# EAGLE design LCD (EAGLE 4.11)
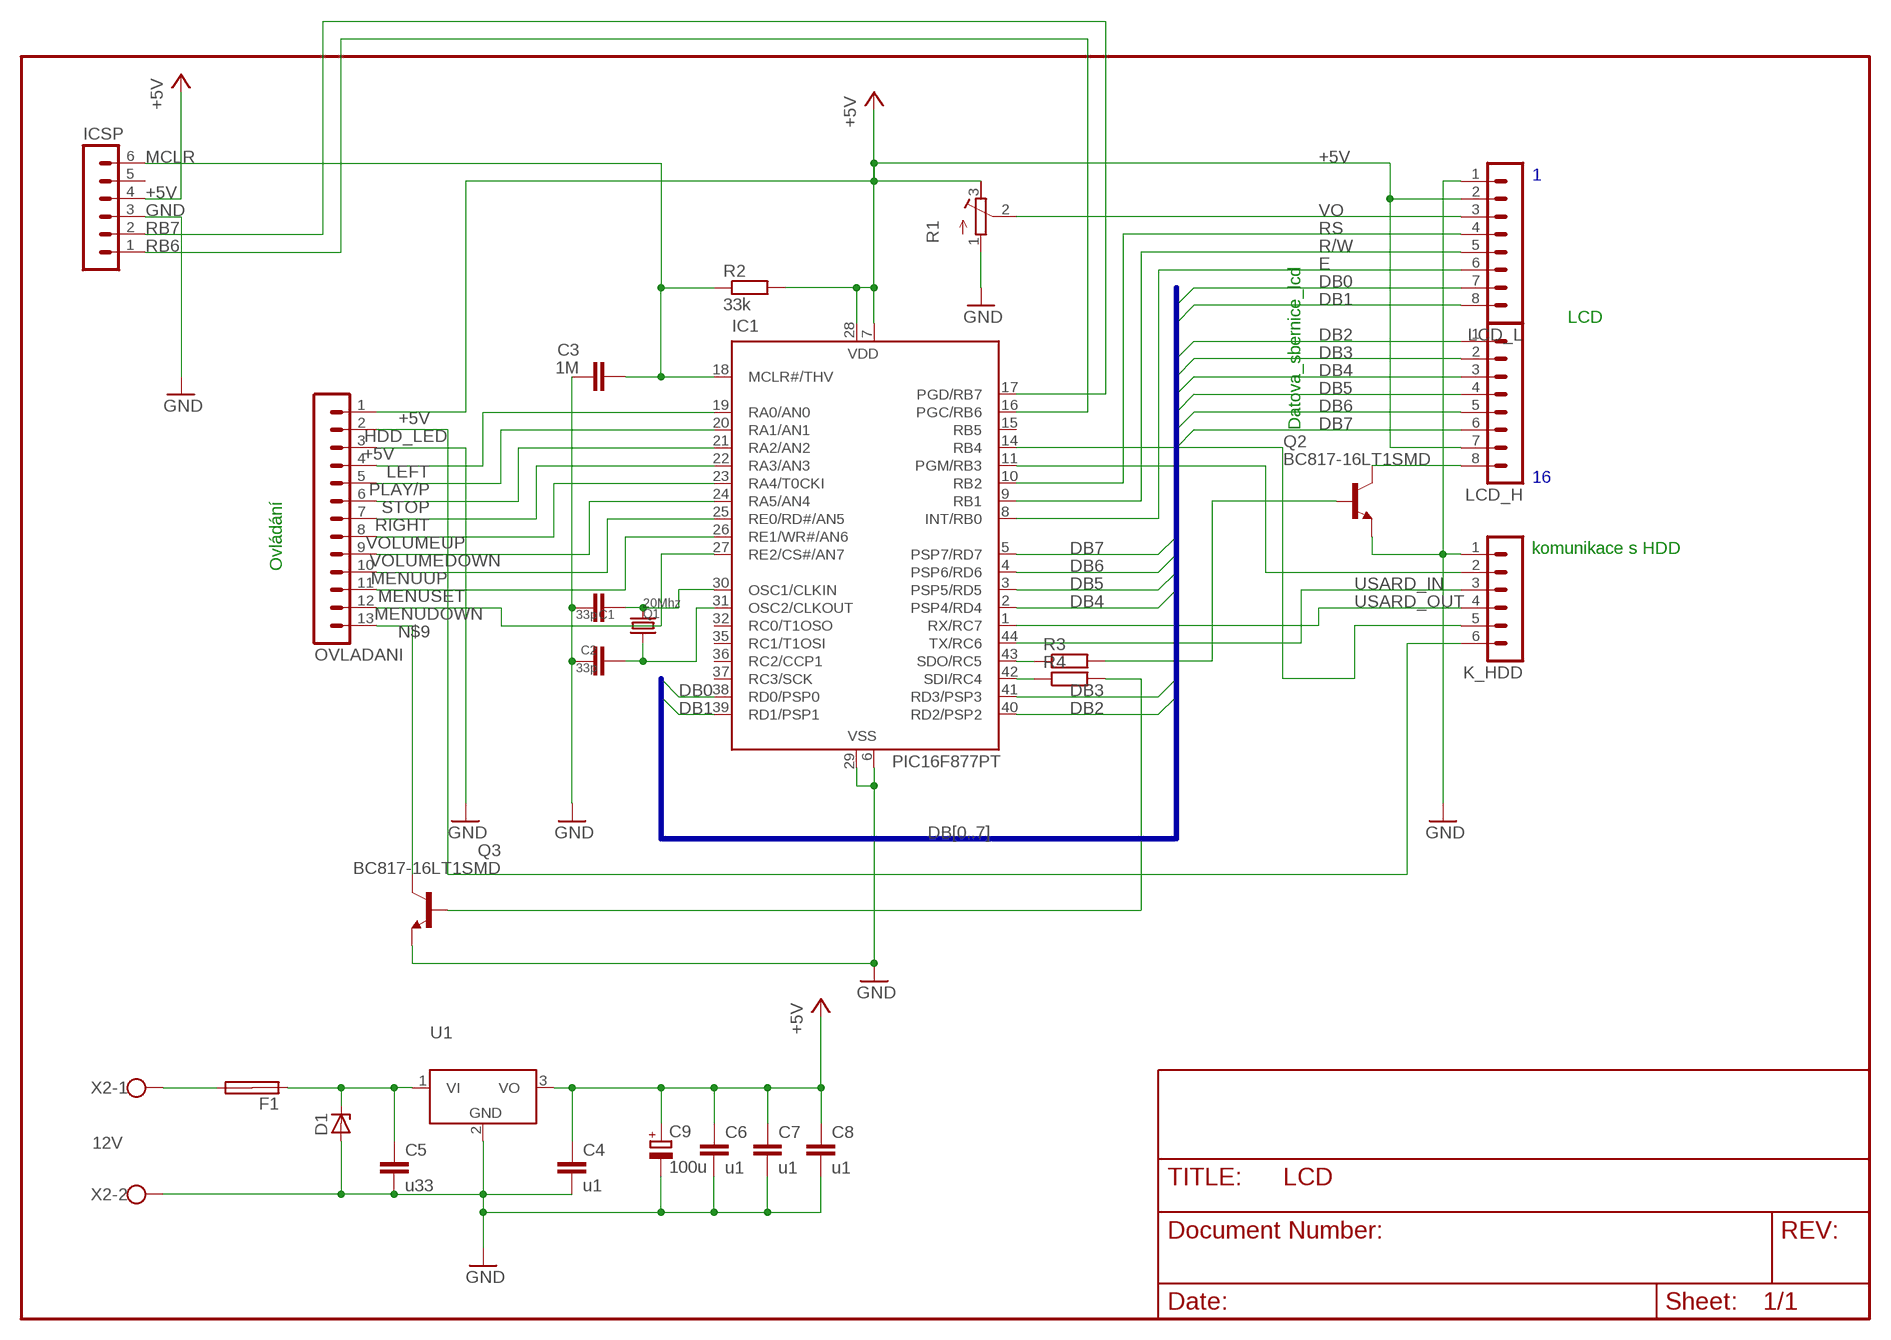
[diagram p0: schematic, sheet 1]

## Parts
C1  33p  C-EUC0805  [C0805]
C2  33p  C-EUC0805  [C0805]
C3  1M  C-EUC0805  [C0805]
C4  u1  C-EUC0603K  [C0603K]
C5  u33  C-EUC0603K  [C0603K]
C6  u1  C-EUC0603K  [C0603K]
C7  u1  C-EUC0603K  [C0603K]
C8  u1  C-EUC0603K  [C0603K]
C9  100u  CPOL-EUE3.5-8  [E3,5-8]
D1  ZENER-DIODEF126-10  [F126Z10]
F1  SHK20L  [SHK20L]
IC1  PIC16F877PT  [TQFP44]
ICSP  MA06-1  [MA06-1]
K_HDD  MA06-1  [MA06-1]
LCD_H  MA08-1  [MA08-1]
LCD_L  MA08-1  [MA08-1]
OVLADANI  MA13-1  [MA13-1]
Q1  20Mhz  CRYTALHC18U-V  [HC18U-V]
Q2  BC817-16LT1SMD  [SOT23-BEC]
Q3  BC817-16LT1SMD  [SOT23-BEC]
R1  R-TRIMM74X  [RTRIM74X]
R2  33k  R-EU_R0805  [R0805]
R3  R-EU_M0805  [M0805]
R4  R-EU_M0805  [M0805]
U1  7806  [TO-220S]
X2  12V  W237-102  [W237-102]

## Nets
+5V: C4.1 C6.1 C7.1 C8.1 C9.+ IC1.7(VDD) IC1.28(VDD) ICSP.4 LCD_H.7 LCD_L.2 OVLADANI.1 R1.3(A) R2.2 U1.3(VO)
DB0: IC1.38(RD0/PSP0) LCD_L.7
DB1: IC1.39(RD1/PSP1) LCD_L.8
DB2: IC1.40(RD2/PSP2) LCD_H.1
DB3: IC1.41(RD3/PSP3) LCD_H.2
DB4: IC1.2(PSP4/RD4) LCD_H.3
DB5: IC1.3(PSP5/RD5) LCD_H.4
DB6: IC1.4(PSP6/RD6) LCD_H.5
DB7: IC1.5(PSP7/RD7) LCD_H.6
E: IC1.8(INT/RB0) LCD_L.6
GND: C1.1 C2.1 C3.1 C4.2 C5.2 C6.2 C7.2 C8.2 C9.- D1.A IC1.6(VSS) IC1.29(VSS) ICSP.3 K_HDD.1 LCD_L.1 OVLADANI.3 Q2.E Q3.E R1.1(E) U1.2(GND) X2.2
HDD_LED: K_HDD.6 OVLADANI.2
LEFT: IC1.19(RA0/AN0) OVLADANI.4
MCLR: C3.2 IC1.18(MCLR#/THV) ICSP.6 R2.1
MENUDOWN: IC1.27(RE2/CS#/AN7) OVLADANI.12
MENUSET: IC1.26(RE1/WR#/AN6) OVLADANI.11
MENUUP: IC1.25(RE0/RD#/AN5) OVLADANI.10
N$1: C1.2 IC1.30(OSC1/CLKIN) Q1.2
N$2: C2.2 IC1.31(OSC2/CLKOUT) Q1.1
N$4: F1.2A X2.1
N$5: C5.1 D1.C F1.1A U1.1(VI)
N$6: LCD_H.8 Q2.C
N$7: IC1.11(PGM/RB3) K_HDD.2
N$8: IC1.43(SDO/RC5) R3.1
N$9: OVLADANI.13 Q3.C
N$10: Q2.B R3.2
N$11: IC1.14(RB4) K_HDD.5
N$12: IC1.42(SDI/RC4) R4.1
N$13: Q3.B R4.2
PLAY/P: IC1.20(RA1/AN1) OVLADANI.5
R/W: IC1.9(RB1) LCD_L.5
RB6: IC1.16(PGC/RB6) ICSP.1
RB7: IC1.17(PGD/RB7) ICSP.2
RIGHT: IC1.22(RA3/AN3) OVLADANI.7
RS: IC1.10(RB2) LCD_L.4
STOP: IC1.21(RA2/AN2) OVLADANI.6
USARD_IN: IC1.44(TX/RC6) K_HDD.3
USARD_OUT: IC1.1(RX/RC7) K_HDD.4
VO: LCD_L.3 R1.2(S)
VOLUMEDOWN: IC1.24(RA5/AN4) OVLADANI.9
VOLUMEUP: IC1.23(RA4/T0CKI) OVLADANI.8
Unconnected: F1.1B F1.2B IC1.15(RB5) IC1.32(RC0/T1OSO) IC1.35(RC1/T1OSI) IC1.36(RC2/CCP1) IC1.37(RC3/SCK) ICSP.5

## Buses
DB[0..7]

## Notes on the sheet
- 1
- LCD
- Datova_sbernice_lcd
- 16
- Ovládání
- komunikace s HDD

## Library data of the parts
C1-C8 = rcl:C-EU: CAPACITOR, European symbol
C9 = rcl:CPOL-EU: POLARIZED CAPACITOR, European symbol
D1 = diode:ZENER-DIODE: Z-Diode
F1 = fuse:SHK20L: FUSE HOLDER 5 x 20 mm, SH contact, SHH1 Schukat, E1073 Buerklin
IC1 = microchip:PIC16F87*: MICROCONTROLLER
ICSP K_HDD = con-lstb:MA06-1: PIN HEADER
LCD_H LCD_L = con-lstb:MA08-1: PIN HEADER
OVLADANI = con-lstb:MA13-1: PIN HEADER
Q1 = crystal:CRYTAL: CRYSTAL
Q2 Q3 = transistor-npn:BC817*: NPN Transistor
R1 = rcl:R-TRIMM: Trimm resistor
R2-R4 = rcl:R-EU_: RESISTOR, European symbol
U1 = GM99:7806
X2 = con-wago-500:W237-102: WAGO SCREW CLAMP

## Board
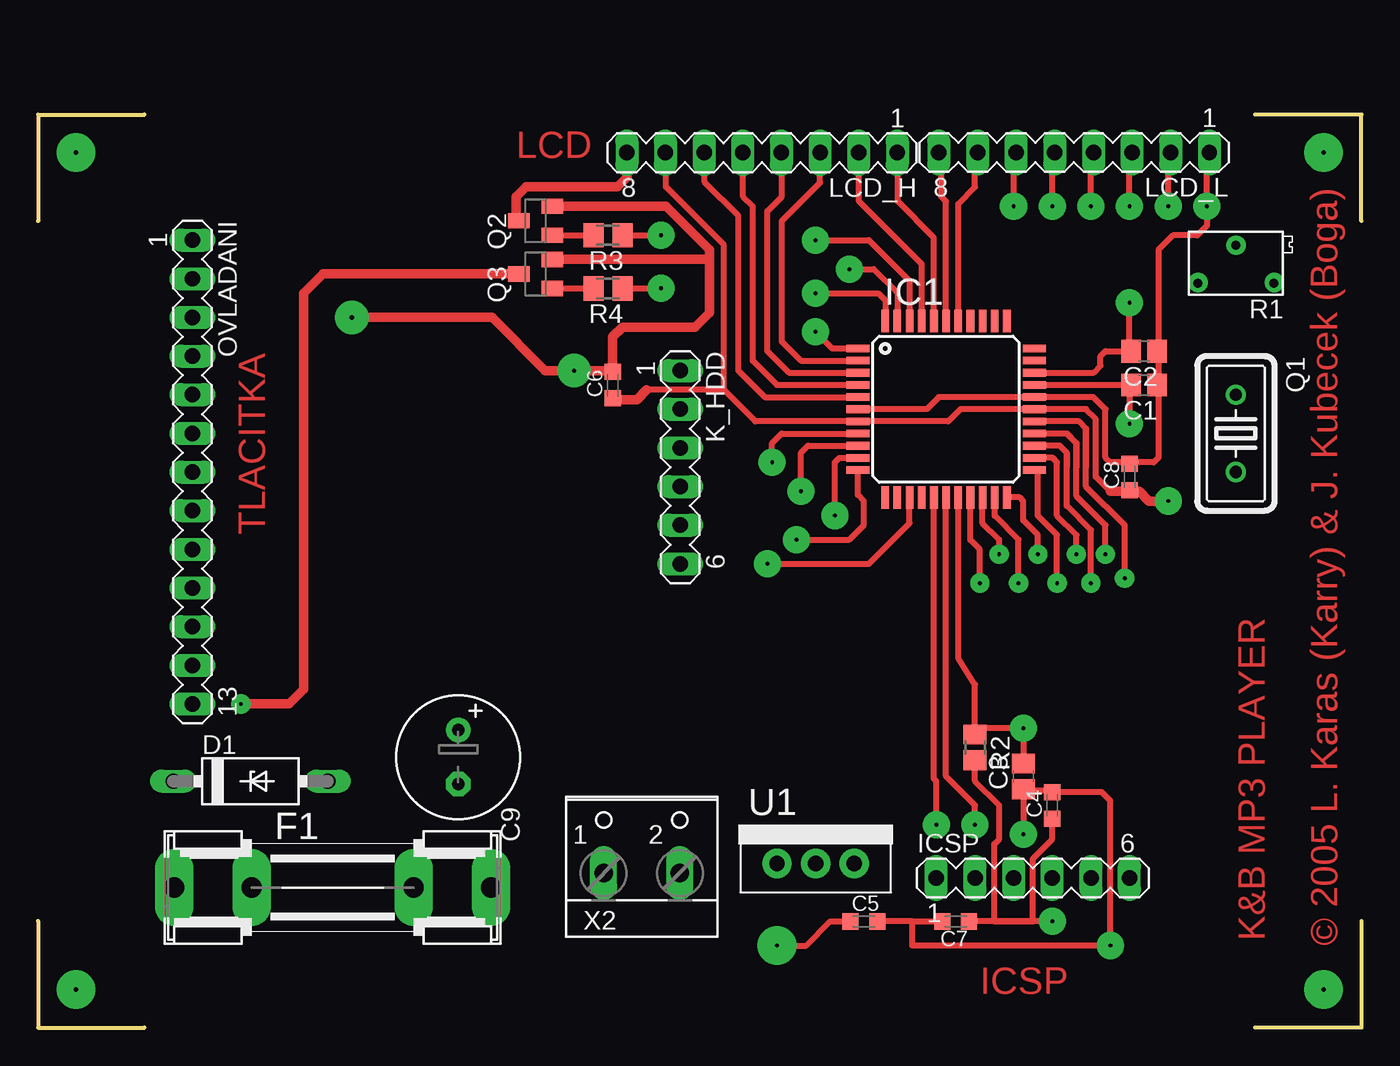
[diagram p1: board, top side]
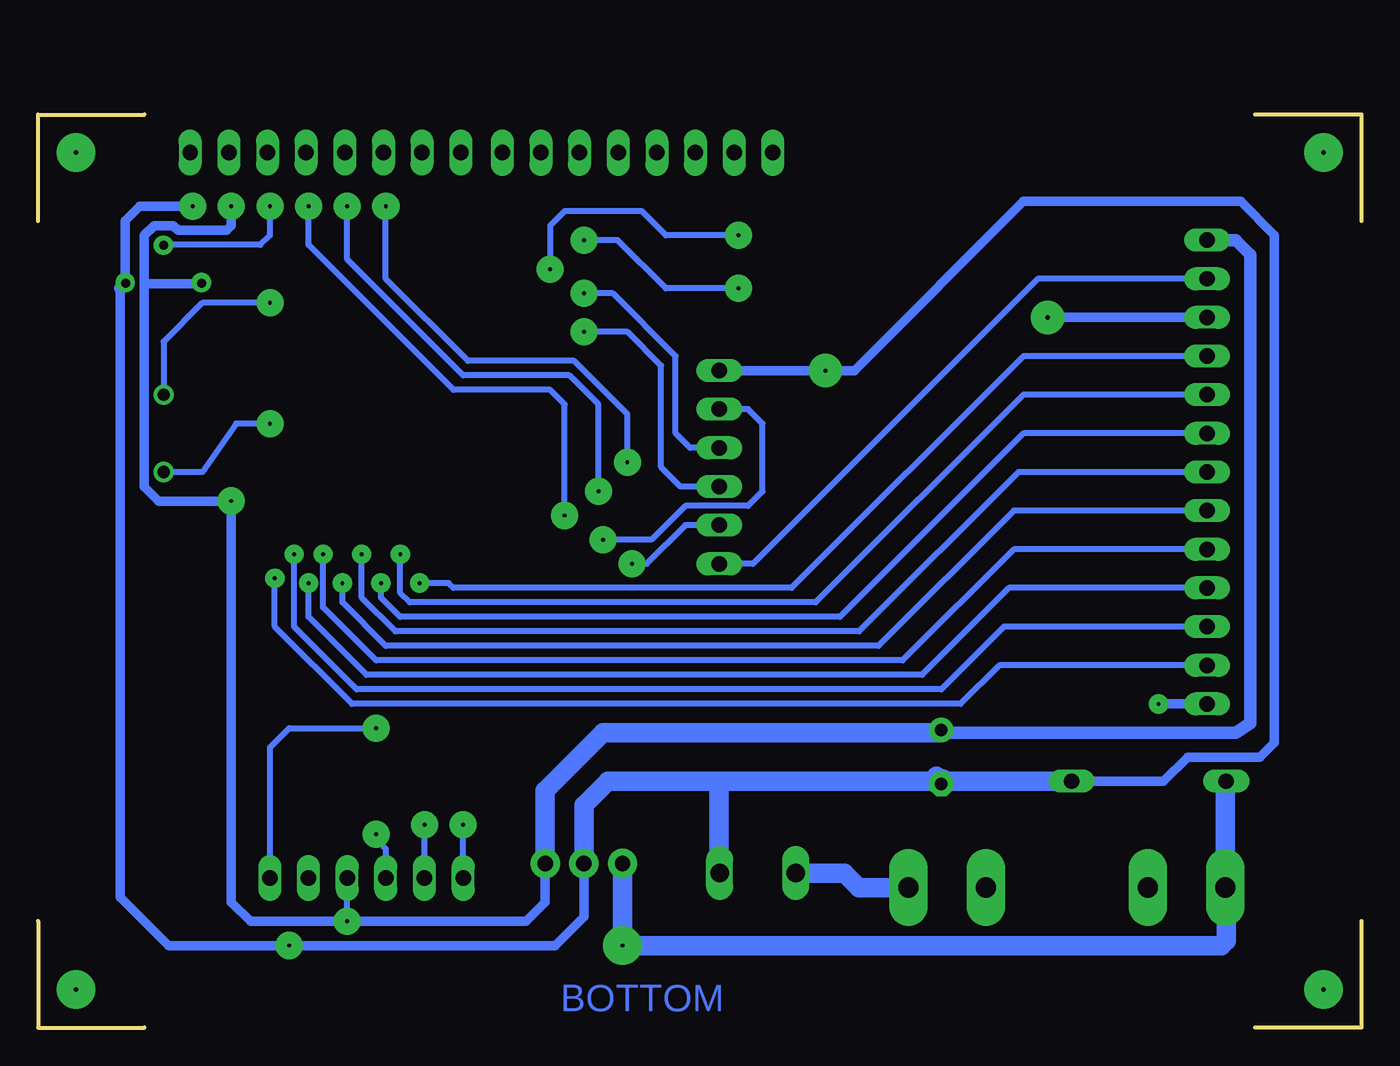
[diagram p2: board, bottom side, seen from below]

Size 87 x 60 mm. Coordinates in mm from the lower left corner, seen from the top.
Outline: 7,60 0,60 0,53
Outline: 0,7 0,0 7,0
Outline: 87,7 87,0 80,0
Outline: 87,53 87,60 80,60
Copper layers (1*16): Top 0.035mm / dielectric 1.5mm / Bottom 0.035mm
Design rules "default": minimum track width 10mil, minimum drill 24mil, track to track 8mil, track to pad 8mil, pad to pad 8mil, via to via 8mil, smd to smd 8mil, copper to edge 40mil, drill to drill 8mil, minimum pad ring 10mil, minimum via ring 8mil, stop-mask expansion 4mil, vias tented up to drill 0mil, thermal gap 10mil

### Footprints (pad centres in the part's own frame; a part is rotated, then mirrored left to right if it is on the bottom)
C0805 = smd 1.3 x 1.5: 1 -0.85,0; 2 0.85,0
C0603K = smd 1.05 x 1.08: 1 -0.875,0; 2 0.875,0
E3,5-8 = drill 0.813 pad 1.6 round: + -1.778,0 | drill 0.813 pad 1.6 octagon: - 1.778,0
F126Z10 = drill 1.016 long: A 5.08,0; C -5.08,0
SHK20L = drill 1.321 pad 2.54 long: 1A -10.414,0; 1B -5.334,0; 2A 10.414,0; 2B 5.334,0
TQFP44 = smd 1.5 x 0.5: 1 -5.8,4; 2 -5.8,3.2; 3 -5.8,2.4; 4 -5.8,1.6; 5 -5.8,0.8; 6 -5.8,0; 7 -5.8,-0.8; 8 -5.8,-1.6; 9 -5.8,-2.4; 10 -5.8,-3.2; 11 -5.8,-4; 23 5.8,-4; 24 5.8,-3.2; 25 5.8,-2.4; 26 5.8,-1.6; 27 5.8,-0.8; 28 5.8,0; 29 5.8,0.8; 30 5.8,1.6; 31 5.8,2.4; 32 5.8,3.2; 33 5.8,4 | smd 0.5 x 1.5: 12 -4,-5.8; 13 -3.2,-5.8; 14 -2.4,-5.8; 15 -1.6,-5.8; 16 -0.8,-5.8; 17 0,-5.8; 18 0.8,-5.8; 19 1.6,-5.8; 20 2.4,-5.8; 21 3.2,-5.8; 22 4,-5.8; 34 4,5.8; 35 3.2,5.8; 36 2.4,5.8; 37 1.6,5.8; 38 0.8,5.8; 39 0,5.8; 40 -0.8,5.8; 41 -1.6,5.8; 42 -2.4,5.8; 43 -3.2,5.8; 44 -4,5.8
MA06-1 = drill 1.016 long: 1 -6.35,0; 2 -3.81,0; 3 -1.27,0; 4 1.27,0; 5 3.81,0; 6 6.35,0
MA08-1 = drill 1.016 long: 1 -8.89,0; 2 -6.35,0; 3 -3.81,0; 4 -1.27,0; 5 1.27,0; 6 3.81,0; 7 6.35,0; 8 8.89,0
MA13-1 = drill 1.016 long: 1 -15.24,0; 2 -12.7,0; 3 -10.16,0; 4 -7.62,0; 5 -5.08,0; 6 -2.54,0; 7 0,0; 8 2.54,0; 9 5.08,0; 10 7.62,0; 11 10.16,0; 12 12.7,0; 13 15.24,0
HC18U-V = drill 0.813 round: 1 -2.54,0; 2 2.54,0
SOT23-BEC = smd 1 x 1.4: B -0.95,-1.1; C 0,1.1; E 0.95,-1.1
RTRIM74X = drill 0.61 round: 1 -1.25,-2.5; 2 1.25,0; 3 -1.25,2.5
R0805 = smd 1.3 x 1.5: 1 -0.85,0; 2 0.85,0
M0805 = smd 1.3 x 1.6: 1 -0.95,0; 2 0.95,0
TO-220S = drill 1.016 pad 1.93 round: 1 0,0; 2 2.54,0; 3 5.08,0
W237-102 = drill 1.194 long: 1 -2.5,-1.27; 2 2.5,-1.27

### Placement (x,y rotation side)
C1  72.71,42.23 180 top
C2  72.71,44.45 180 top
C3  64.77,16.51 90 top
C4  66.67,14.61 90 top
C5  54.29,6.99 0 top
C6  37.78,42.23 90 top
C7  60.33,6.99 180 top
C8  71.75,36.2 90 top
C9  27.62,17.78 270 top
D1  13.97,16.19 0 top
F1  19.37,9.21 0 top
IC1  59.69,40.64 0 top
ICSP  65.41,9.84 0 top
K_HDD  42.23,36.83 270 top
LCD_H  47.6,57.5 180 top
LCD_L  68.11,57.52 180 top
OVLADANI  10.16,36.51 270 top
Q1  78.74,39.05 270 top
Q2  32.7,53.02 90 top
Q3  32.7,49.53 90 top
R1  78.74,50.16 90 top
R2  61.59,18.41 270 top
R3  37.47,52.07 180 top
R4  37.47,48.58 180 top
U1  48.58,10.79 0 top
X2  39.69,11.43 0 top

### Tracks (layer width: path | path; a pad name or v marks a point on that pad's centre or on a via)
+5V  (via drill 0.25 pad 1.78)
  Top 0.406: 45.09,41.91 47.16,39.84 IC1.7 59.84,39.84 60.64,40.64 IC1.28 68.9,40.64 69.53,40.01 69.53,36.2 70.48,35.24 71.75,35.24 | 45.09,41.91 45.09,51.44 41.27,55.24 41.27,57.47 LCD_H.7 | LCD_L.2 74.46,57.31 74.3,57.15 v74.3,53.98 | R2.2 61.59,16.19 63.18,14.61 63.18,12.38 62.87,12.06 62.87,6.99 | 72.39,35.24 71.75,35.24 | 71.75,35.24 C8.1 | C4.1 66.67,12.38 65.41,11.11 65.41,6.99 62.87,6.99 | v66.67,6.99 62.87,6.99 | 62.87,6.99 C7.1 | 37.78,41.27 C6.1 | 45.09,41.91 40.01,41.91
  Top 0.61: 40.01,41.91 39.37,41.27 37.78,41.27 | 70.48,35.24 72.39,35.24 73.03,34.61 v74.3,34.61
  Bottom 0.406: 76.2,48.9 76.22,48.91 R1.3 | v66.67,6.99 ICSP.4
  Bottom 0.61: v74.3,53.98 74.3,52.7 74.61,52.39 77.79,52.39 78.11,52.7 79.38,52.7 80.01,52.07 80.01,48.9 | 80.01,48.9 76.2,48.9 | 80.01,48.9 80.01,35.56 79.06,34.61 v74.3,34.61 74.3,8.26 73.03,6.99 v66.67,6.99 54.93,6.99 53.66,8.26 U1.3
  Bottom 0.813: 27.62,19.37 8.26,19.37 7.3,20 7.3,46.67 7.3,50.8 8.26,51.75 OVLADANI.1
  Bottom 1.27: U1.3 53.66,15.56 49.85,19.37 27.62,19.37 C9.+
DB0
  Top 0.406: IC1.38 60.49,54.14 61.59,55.24 61.59,57.15 61.91,57.47 61.86,57.52 LCD_L.7
DB1
  Top 0.406: IC1.39 59.69,54.29 59.37,54.61 59.37,57.47 59.32,57.52 LCD_L.8
DB2
  Top 0.406: IC1.40 58.89,51.92 56.52,54.29 56.52,57.47 LCD_H.1
DB3
  Top 0.406: IC1.41 58.09,50.18 53.98,54.29 53.98,57.47 LCD_H.2
DB4
  Top 0.406: 51.44,57.47 51.44,57.5 LCD_H.3 51.41,55.53 48.9,53.02 48.9,45.09 50.14,43.84 IC1.2
DB5
  Top 0.406: IC1.3 49.35,43.04 47.94,44.45 47.94,53.66 48.9,54.61 48.9,57.47 LCD_H.4
DB6
  Top 0.406: IC1.4 48.56,42.24 46.99,43.81 46.99,53.98 46.35,54.61 46.35,57.47 LCD_H.5
DB7
  Top 0.406: IC1.5 47.78,41.44 46.04,43.18 46.04,53.34 43.81,55.56 43.81,57.47 LCD_H.6
E  (via drill 0.25 pad 1.78)
  Top 0.406: LCD_L.6 64.3,56.99 64.14,56.83 v64.14,53.98 | IC1.8 48.88,39.04 48.26,38.42 v48.26,37.15
  Bottom 0.406: v48.26,37.15 48.26,40.32 51.75,43.81 58.74,43.81 64.14,49.21 v64.14,53.98
GND  (via drill 0.25 pad 1.78, 0.25 pad 2.18, 0.3 pad 2.18)
  Top 0.406: IC1.6 58.42,40.64 59.22,41.44 IC1.29 69.37,41.44 70.17,40.64 70.17,37.47 70.48,37.15 71.75,37.15 | LCD_L.1 77,56.99 76.83,56.83 v76.83,53.98 76.83,52.7 76.2,52.07 74.61,52.07 73.66,51.12 73.66,44.45 | 73.66,44.45 C2.1 | 73.66,44.45 73.66,42.23 | 73.66,42.23 C1.1 | 71.75,37.15 73.34,37.15 73.66,37.47 73.66,42.23 | 71.75,37.15 C8.2 | 64.77,15.56 C3.1 | 64.77,15.56 66.67,15.56 C4.2 69.93,15.48 70.48,14.92 v70.48,5.4 57.47,5.4 57.47,6.99 | 64.77,15.56 v64.77,12.7 | 57.47,6.99 C7.2 | 57.47,6.99 C5.2 | 37.78,43.18 C6.2 | 44.13,50.48
  Top 0.61: Q2.E 41.28,53.97 44.13,51.12 44.13,50.48 44.13,46.99 43.18,46.04 38.42,46.04 37.78,45.4 37.78,43.18 v35.24,43.18 33.34,43.18 29.84,46.67 v20.64,46.67 | 44.13,50.48 Q3.E
  Bottom 0.406: v64.77,12.7 64.77,12.38 64.14,11.75 ICSP.3 | 18.1,16.19 18.41,15.88 18.73,15.88 D1.A
  Bottom 0.61: v76.83,53.98 80.33,53.98 81.28,53.02 81.28,48.9 | U1.2 51.12,7.3 53.02,5.4 v70.48,5.4 78.42,5.4 81.6,8.57 81.6,48.58 | 18.1,16.19 13.02,16.19 11.43,17.78 6.67,17.78 5.71,18.73 5.71,52.07 7.94,54.29 22.23,54.29 33.34,43.18 v35.24,43.18 K_HDD.1 | v20.64,46.67 OVLADANI.3
  Bottom 0.813: R1.1 81.26,48.91 81.28,48.9 81.6,48.58
  Bottom 1.27: D1.A 27.62,16.19 | 27.62,16.19 42.23,16.19 | X2.2 42.19,9.88 42.23,9.84 42.23,16.19 | 27.62,16.19 27.94,16.51 27.5,16.32 C9.- | U1.2 51.12,14.61 49.53,16.19 42.23,16.19
HDD_LED
  Bottom 0.406: OVLADANI.2 21.27,49.21 40.01,30.48 K_HDD.6
LEFT  (via drill 0.25 pad 1.27)
  Top 0.406: IC1.19 61.29,32.05 61.91,31.43 v61.91,29.21
  Bottom 0.406: v61.91,29.21 60.01,29.21 59.69,28.89 37.47,28.89 22.23,44.13 OVLADANI.4
MCLR  (via drill 0.25 pad 1.78)
  Top 0.406: IC1.18 60.49,24.28 61.59,22.54 61.59,19.68 | 61.59,19.68 R2.1 | 61.59,19.68 v64.77,19.68 C3.2
  Bottom 0.406: v64.77,19.68 70.48,19.68 71.75,18.41 ICSP.6
MENUDOWN  (via drill 0.25 pad 1.27)
  Top 0.406: 68.9,39.37 68.9,36.83 | IC1.27 68.43,39.84 68.9,39.37 | 68.9,39.37 68.9,35.56 71.44,33.02 v71.44,29.53
  Bottom 0.406: v71.44,29.53 71.44,26.35 66.36,21.27 26.35,21.27 23.81,23.81 OVLADANI.12
MENUSET  (via drill 0.25 pad 1.27)
  Top 0.406: 68.26,38.42 67.64,39.04 IC1.26 67.61,39.04 67.63,39.05 68.26,38.42 | 68.26,38.42 68.26,36.83 | 68.26,38.42 68.26,34.92 70.17,33.02 v70.17,31.11
  Bottom 0.406: v70.17,31.11 70.17,26.35 66.04,22.23 27.62,22.23 23.5,26.35 10.48,26.35 10.16,26.67 OVLADANI.11
MENUUP  (via drill 0.25 pad 1.27)
  Top 0.406: 67.63,37.78 67.63,36.83 | IC1.25 67.17,38.24 67.63,37.78 | 67.63,37.78 67.63,34.29 69.22,32.7 v69.22,29.21
  Bottom 0.406: v69.22,29.21 69.22,26.99 65.41,23.18 28.89,23.18 23.18,28.89 OVLADANI.10
N$1  (via drill 0.25 pad 1.78)
  Top 0.406: IC1.30 71.74,42.24 71.75,42.23 | 71.75,42.23 C1.2 | 71.75,42.23 v71.75,39.69
  Bottom 0.406: v71.75,39.69 73.98,39.69 76.2,36.51 Q1.2
N$2  (via drill 0.25 pad 1.78)
  Top 0.406: IC1.31 69.39,43.04 69.85,43.5 69.85,44.13 70.17,44.45 71.75,44.45 | 71.75,44.45 C2.2 | 71.75,44.45 v71.75,47.62
  Bottom 0.406: v71.75,47.62 76.2,47.62 78.74,45.09 Q1.1
N$3  (via drill 0.25 pad 1.78)
  other vias: 51.12,48.26
N$4
  Bottom 1.27: F1.2A 33.02,9.21 33.97,10.16 X2.1
N$5  (via drill 0.25 pad 2.54)
  Top 0.406: v48.58,5.4 50.48,5.4 52.07,6.99 C5.1
  Bottom 1.27: D1.C 8.95,16.13 F1.1A 8.95,8.95 8.89,8.89 8.89,5.71 9.21,5.4 v48.58,5.4 U1.1
N$6
  Top 0.406: Q2.C 31.43,53.02 | 38.73,57.47 LCD_H.8
  Top 0.61: 31.43,53.02 31.43,54.61 32.07,55.24 38.1,55.24 38.73,55.88 38.73,57.47
N$7  (via drill 0.25 pad 1.78)
  Top 0.406: IC1.11 53.89,35.01 54.29,34.61 54.29,33.02 53.34,32.07 v49.85,32.07
  Bottom 0.406: v49.85,32.07 46.67,32.07 44.45,34.29 40.32,34.29 39.37,35.24 39.37,39.69 40.32,40.64 K_HDD.2
N$8  (via drill 0.25 pad 1.78)
  Top 0.406: IC1.43 56.49,48.28 54.93,49.85 v53.34,49.85 | R3.1 v40.96,52.07
  Bottom 0.406: v40.96,52.07 45.72,52.07 47.31,53.66 52.39,53.66 53.34,52.7 v53.34,49.85
N$9  (via drill 0.25 pad 1.27)
  Top 0.61: v13.34,21.27 16.51,21.27 17.46,22.23 17.46,48.26 18.73,49.53 Q3.C
  Bottom 0.61: OVLADANI.13 v13.34,21.27
N$10
  Top 0.406: Q2.B 33.97,52.07 R3.2
N$11  (via drill 0.25 pad 1.78)
  Top 0.406: IC1.14 57.29,33.16 54.61,30.48 v47.94,30.48
  Bottom 0.406: v47.94,30.48 46.99,30.48 44.45,33.02 K_HDD.5
N$12  (via drill 0.25 pad 1.78)
  Top 0.406: IC1.42 57.29,49.07 54.61,51.75 v51.12,51.75 | R4.1 v40.96,48.58
  Bottom 0.406: v40.96,48.58 45.72,48.58 48.9,51.75 v51.12,51.75
N$13
  Top 0.406: Q3.B 33.97,48.58 R4.2
N$14  (via drill 0.3 pad 2.54)
  other vias: 2.5,2.5
N$15  (via drill 0.3 pad 2.54)
  other vias: 2.5,57.5
N$16  (via drill 0.3 pad 2.54)
  other vias: 84.5,57.5
N$17  (via drill 0.3 pad 2.54)
  other vias: 84.5,2.5
N$20  (via drill 0.25 pad 1.78)
  other vias: 64.77,12.7
N$21  (via drill 0.25 pad 1.78)
  other vias: 66.67,6.99
N$22  (via drill 0.25 pad 1.27)
  other vias: 77,57.52
N$23  (via drill 0.25 pad 1.27)
  other vias: 74.46,57.52
N$24  (via drill 0.25 pad 1.27)
  other vias: 71.92,57.5
N$25  (via drill 0.25 pad 1.27)
  other vias: 69.37,57.5
N$26  (via drill 0.25 pad 1.27)
  other vias: 66.84,57.52
N$27  (via drill 0.25 pad 1.27)
  other vias: 64.33,57.51
N$28  (via drill 0.25 pad 1.27)
  other vias: 61.78,57.56
N$29  (via drill 0.25 pad 1.27)
  other vias: 59.2,57.56
N$30  (via drill 0.25 pad 1.27)
  other vias: 56.48,57.54
N$31  (via drill 0.25 pad 1.27)
  other vias: 53.96,57.52
N$32  (via drill 0.25 pad 1.27)
  other vias: 51.42,57.49
N$33  (via drill 0.25 pad 1.27)
  other vias: 48.86,57.52
N$34  (via drill 0.25 pad 1.27)
  other vias: 46.3,57.52
N$35  (via drill 0.25 pad 1.27)
  other vias: 38.72,57.48
N$36  (via drill 0.25 pad 1.27)
  other vias: 41.23,57.54
N$37  (via drill 0.25 pad 1.27)
  other vias: 43.84,57.54
N$38  (via drill 0.25 pad 1.27)
  other vias: 81.27,48.96
N$39  (via drill 0.25 pad 1.27)
  other vias: 78.75,51.42
N$40  (via drill 0.25 pad 1.27)
  other vias: 76.25,48.96
N$41  (via drill 0.25 pad 1.27)
  other vias: 78.75,41.58
N$42  (via drill 0.25 pad 1.27)
  other vias: 78.75,36.49
N$43  (via drill 0.25 pad 1.27)
  other vias: 71.78,9.9
N$44  (via drill 0.25 pad 1.27)
  other vias: 69.21,9.82
N$45  (via drill 0.25 pad 1.27)
  other vias: 66.68,9.82
N$46  (via drill 0.25 pad 1.27)
  other vias: 64.15,9.82
N$47  (via drill 0.25 pad 1.27)
  other vias: 61.62,9.82
N$48  (via drill 0.25 pad 1.27)
  other vias: 59.05,9.9
N$49  (via drill 0.25 pad 1.27)
  other vias: 53.66,10.79
N$50  (via drill 0.25 pad 1.27)
  other vias: 51.13,10.79
N$51  (via drill 0.25 pad 1.27)
  other vias: 48.56,10.83
N$52  (via drill 0.25 pad 1.27)
  other vias: 42.15,10.16
N$53  (via drill 0.25 pad 1.27)
  other vias: 37.18,10.16
N$54  (via drill 0.25 pad 1.27)
  other vias: 42.23,43.17
N$55  (via drill 0.25 pad 1.27)
  other vias: 42.21,40.69
N$56  (via drill 0.25 pad 1.27)
  other vias: 42.21,38.11
N$57  (via drill 0.25 pad 1.27)
  other vias: 42.17,35.57
N$58  (via drill 0.25 pad 1.27)
  other vias: 42.19,33.05
N$59  (via drill 0.25 pad 1.27)
  other vias: 42.21,30.48
N$60  (via drill 0.25 pad 1.27)
  other vias: 27.65,16.01
N$61  (via drill 0.25 pad 1.27)
  other vias: 27.65,19.58
N$62  (via drill 0.25 pad 1.27)
  other vias: 19.11,16.19
N$63  (via drill 0.25 pad 1.27)
  other vias: 8.9,16.19
N$64  (via drill 0.25 pad 1.78)
  other vias: 8.98,9.16
N$65  (via drill 0.25 pad 1.78)
  other vias: 13.99,9.19
N$66  (via drill 0.25 pad 1.78)
  other vias: 24.7,9.22
N$67  (via drill 0.25 pad 1.78)
  other vias: 29.76,9.28
N$68  (via drill 0.25 pad 1.02)
  other vias: 10.15,51.75
N$69  (via drill 0.25 pad 1.02)
  other vias: 10.15,49.23
N$70  (via drill 0.25 pad 1.02)
  other vias: 10.15,46.68
N$71  (via drill 0.25 pad 1.02)
  other vias: 10.15,44.14
N$72  (via drill 0.25 pad 1.02)
  other vias: 10.18,41.59
N$73  (via drill 0.25 pad 1.02)
  other vias: 10.16,21.25
N$74  (via drill 0.25 pad 1.02)
  other vias: 10.16,23.8
N$75  (via drill 0.25 pad 1.02)
  other vias: 10.19,26.34
N$76  (via drill 0.25 pad 1.02)
  other vias: 10.13,28.92
N$77  (via drill 0.25 pad 1.02)
  other vias: 10.13,31.46
N$78  (via drill 0.25 pad 1.02)
  other vias: 10.13,33.98
N$79  (via drill 0.25 pad 1.02)
  other vias: 10.19,36.53
N$80  (via drill 0.25 pad 1.02)
  other vias: 10.15,39.09
PLAY/P  (via drill 0.25 pad 1.27)
  Top 0.406: IC1.20 62.09,33.16 63.18,32.07 v63.18,31.11
  Bottom 0.406: v63.18,31.11 63.18,28.57 62.55,27.94 35.88,27.94 22.23,41.59 10.48,41.59 10.16,41.27 OVLADANI.5
R/W  (via drill 0.25 pad 1.78)
  Top 0.406: LCD_L.5 66.73,57.52 66.67,57.47 v66.67,53.98 | IC1.9 50.62,38.24 50.16,37.78 v50.16,35.24
  Bottom 0.406: v66.67,53.98 66.67,50.48 59.05,42.86 52.07,42.86 50.16,40.96 v50.16,35.24
RB6  (via drill 0.25 pad 1.78)
  Top 0.406: v59.05,13.34 59.05,16.19 58.89,16.36 IC1.16
  Bottom 0.406: ICSP.1 v59.05,13.34
RB7  (via drill 0.25 pad 1.78)
  Top 0.406: v61.59,13.34 61.59,14.61 59.69,16.51 IC1.17
  Bottom 0.406: ICSP.2 v61.59,13.34
RIGHT  (via drill 0.25 pad 1.27)
  Top 0.406: IC1.22 64.54,34.84 64.77,34.61 64.77,33.34 65.72,32.38 v65.72,31.11
  Bottom 0.406: v65.72,31.11 65.72,28.26 63.5,26.04 33.02,26.04 22.54,36.51 OVLADANI.7
RS  (via drill 0.25 pad 1.78)
  Top 0.406: LCD_L.4 69.27,57.52 69.22,57.47 v69.22,53.98 | IC1.10 52.68,37.44 52.39,37.15 v52.39,33.66
  Bottom 0.406: v52.39,33.66 52.39,40.96 53.34,41.91 59.69,41.91 69.22,51.44 v69.22,53.98
STOP  (via drill 0.25 pad 1.27)
  Top 0.406: IC1.21 62.89,33.63 64.45,32.07 v64.45,29.21
  Bottom 0.406: v64.45,29.21 64.45,28.26 63.18,26.99 34.29,26.99 22.23,39.05 OVLADANI.6
USARD_IN  (via drill 0.25 pad 1.78)
  Top 0.406: IC1.44 55.69,47.81 55.24,48.26 v51.12,48.26
  Bottom 0.406: v51.12,48.26 49.21,48.26 45.09,44.13 45.09,39.05 44.13,38.1 K_HDD.3
USARD_OUT  (via drill 0.25 pad 1.78)
  Top 0.406: IC1.1 52.2,44.64 v51.12,45.72
  Bottom 0.406: v51.12,45.72 48.26,45.72 46.04,43.5 46.04,36.83 44.77,35.56 K_HDD.4
VO  (via drill 0.25 pad 1.78)
  Top 0.406: LCD_L.3 71.92,57.31 71.75,57.15 v71.75,53.98
  Bottom 0.406: v71.75,53.98 71.75,52.07 72.39,51.44 78.74,51.44 R1.2
VOLUMEDOWN  (via drill 0.25 pad 1.27)
  Top 0.406: 66.99,37.15 66.7,37.44 IC1.24 66.65,37.44 66.67,37.47 66.99,37.15 | 66.99,37.15 66.99,33.66 68.26,32.38 v68.26,31.11
  Bottom 0.406: v68.26,31.11 68.26,27.62 64.77,24.13 30.16,24.13 22.86,31.43 OVLADANI.9 9.84,31.43
VOLUMEUP  (via drill 0.25 pad 1.27)
  Top 0.406: IC1.23 65.59,36.64 65.72,36.51 65.72,33.66 66.99,32.38 v66.99,29.21
  Bottom 0.406: v66.99,29.21 66.99,27.94 64.14,25.08 31.75,25.08 22.86,33.97 OVLADANI.8

### Text on the board
Top: LCD | TLACITKA | K&B MP3 PLAYER | © 2005 L. Karas (Karry) & J. Kubecek (Boga) | ICSP
Bottom: BOTTOM